# Altium schematic sheet uProcesador.SchDoc
size A4
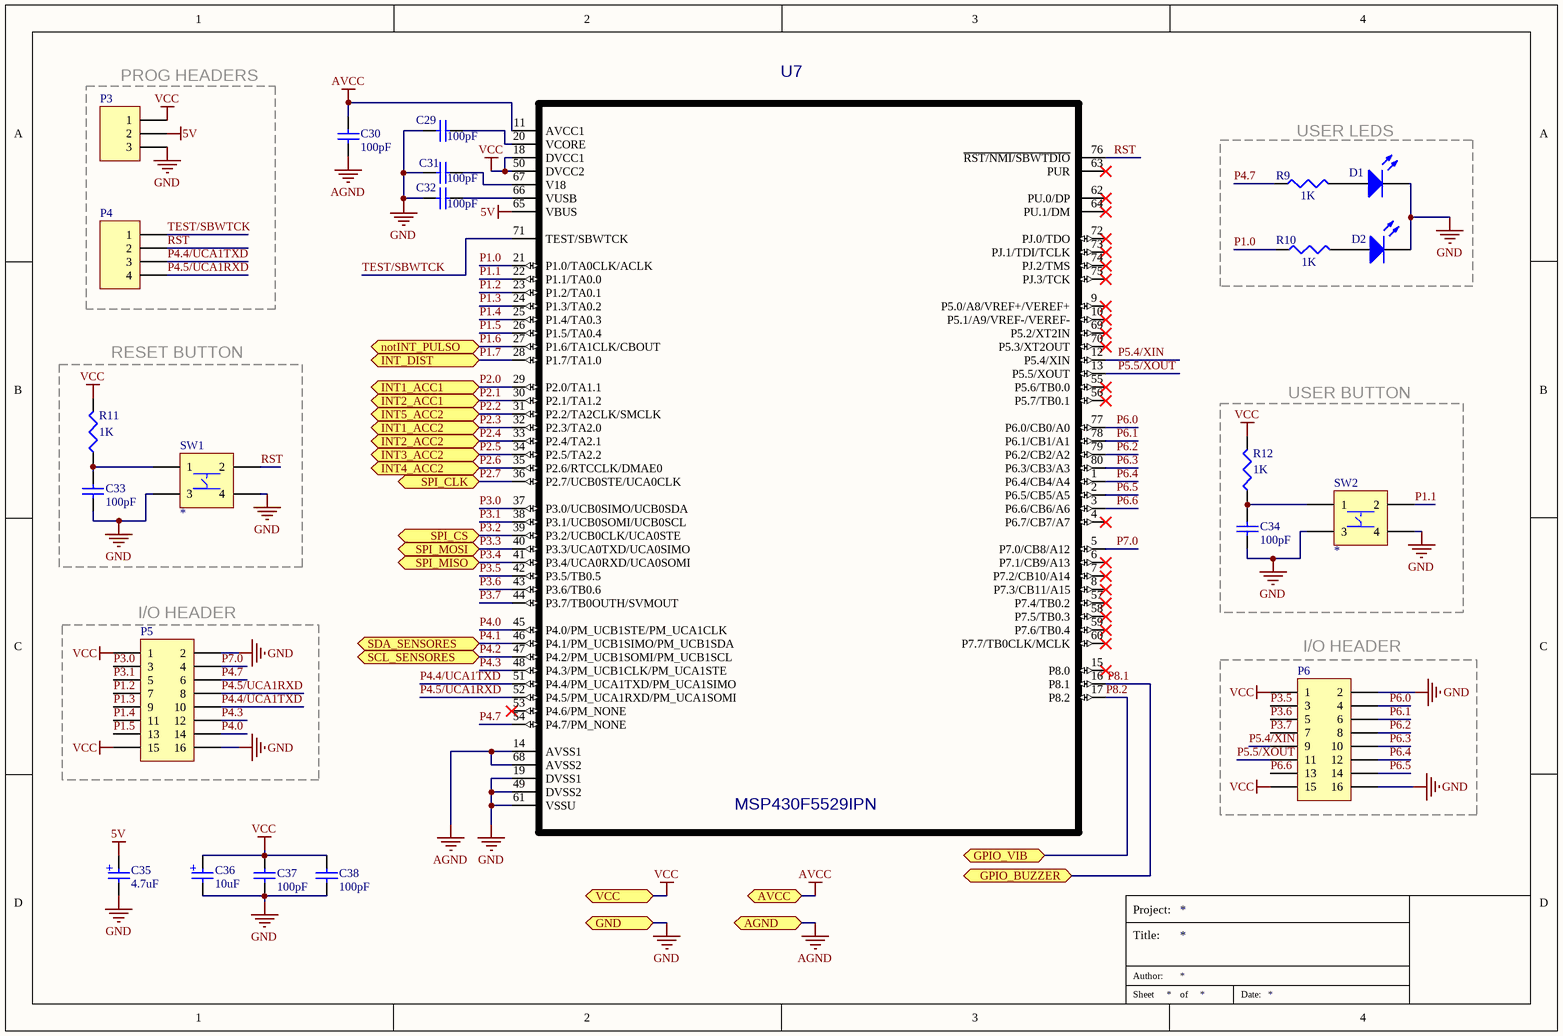
[diagram p0: uProcesador.SchDoc]

## Parts
C29  value 100pF  [C1206]
C30  value 100pF  [C1206]
C31  value 100pF  [C1206]
C32  value 100pF  [C1206]
C33  value 100pF  [C1206]
C34  value 100pF  [C1206]
C35  value 4.7uF  [Cap Pol]
C36  value 10uF  [Cap Pol]
C37  value 100pF  [C1206]
C38  value 100pF  [C1206]
D1  (no value)  [3.2X1.6X1.1]
D2  (no value)  [3.2X1.6X1.1]
P3  (no value)  [HDR1X3]
P4  (no value)  [HDR1X4]
P5  (no value)  [HDR2X8]
P6  (no value)  [HDR2X8]
R9  value 1K  [J1-0603]
R10  value 1K  [J1-0603]
R11  value 1K  [J1-0603]
R12  value 1K  [J1-0603]
SW1  *  [CKN9085CT]
SW2  *  [CKN9085CT]
U7  MSP430F5529IPN  [QFP50P1400X1400X160-80N]

## Ports
AGND, AVCC, GND, GPIO_BUZZER, GPIO_VIB, INT1_ACC1, INT1_ACC2, INT2_ACC1, INT2_ACC2, INT3_ACC2, INT4_ACC2, INT5_ACC2, INT_DIST, notINT_PULSO, SCL_SENSORES, SDA_SENSORES, SPI_CLK, SPI_CS, SPI_MISO, SPI_MOSI, VCC

## Nets
5V: C35.2 P3.2 U7.65(VBUS)
AGND: C30.1 U7.14(AVSS1) U7.68(AVSS2) ; port AGND
AVCC: C30.2 U7.11(AVCC1) ; port AVCC
GND: C29.2 C31.2 C32.2 C33.1 C34.1 C35.1 C36.1 C37.1 C38.1 D1.2(K) D2.2(K) P3.3 P5.2 P5.16 P6.2 P6.16 SW1.3 SW1.4 SW2.3 SW2.4 U7.19(DVSS1) U7.49(DVSS2) U7.61(VSSU) ; port GND
VCC: C36.2 C37.2 C38.2 P3.1 P5.1 P5.15 P6.1 P6.15 R11.2 R12.2 U7.18(DVCC1) U7.50(DVCC2) ; port VCC
P1.0: R10.1 U7.21(P1.0/TA0CLK/ACLK)
P1.1: SW2.2 U7.22(P1.1/TA0.0)
P1.2: P5.7 U7.23(P1.2/TA0.1)
P1.3: P5.9 U7.24(P1.3/TA0.2)
P1.4: P5.11 U7.25(P1.4/TA0.3)
P1.5: P5.13 U7.26(P1.5/TA0.4)
P1.6: U7.27(P1.6/TA1CLK/CBOUT) ; port notINT_PULSO
P1.7: U7.28(P1.7/TA1.0) ; port INT_DIST
P2.0: U7.29(P2.0/TA1.1) ; port INT1_ACC1
P2.1: U7.30(P2.1/TA1.2) ; port INT2_ACC1
P2.2: U7.31(P2.2/TA2CLK/SMCLK) ; port INT5_ACC2
P2.3: U7.32(P2.3/TA2.0) ; port INT1_ACC2
P2.4: U7.33(P2.4/TA2.1) ; port INT2_ACC2
P2.5: U7.34(P2.5/TA2.2) ; port INT3_ACC2
P2.6: U7.35(P2.6/RTCCLK/DMAE0) ; port INT4_ACC2
P2.7: U7.36(P2.7/UCB0STE/UCA0CLK) ; port SPI_CLK
P3.0: P5.3 U7.37(P3.0/UCB0SIMO/UCB0SDA)
P3.1: P5.5 U7.38(P3.1/UCB0SOMI/UCB0SCL)
P3.2: U7.39(P3.2/UCB0CLK/UCA0STE) ; port SPI_CS
P3.3: U7.40(P3.3/UCA0TXD/UCA0SIMO) ; port SPI_MOSI
P3.4: U7.41(P3.4/UCA0RXD/UCA0SOMI) ; port SPI_MISO
P3.5: P6.3 U7.42(P3.5/TB0.5)
P3.6: P6.5 U7.43(P3.6/TB0.6)
P3.7: P6.7 U7.44(P3.7/TB0OUTH/SVMOUT)
P4.0: P5.14 U7.45(P4.0/PM_UCB1STE/PM_UCA1CLK)
P4.1: U7.46(P4.1/PM_UCB1SIMO/PM_UCB1SDA) ; port SDA_SENSORES
P4.2: U7.47(P4.2/PM_UCB1SOMI/PM_UCB1SCL) ; port SCL_SENSORES
P4.3: P5.12 U7.48(P4.3/PM_UCB1CLK/PM_UCA1STE)
P4.4/UCA1TXD: P4.3 P5.10 U7.51(P4.4/PM_UCA1TXD/PM_UCA1SIMO)
P4.5/UCA1RXD: P4.4 P5.8 U7.52(P4.5/PM_UCA1RXD/PM_UCA1SOMI)
P4.7: P5.6 R9.1 U7.54(P4.7/PM_NONE)
P5.4/XIN: P6.9 U7.12(P5.4/XIN)
P5.5/XOUT: P6.11 U7.13(P5.5/XOUT)
P6.0: P6.4 U7.77(P6.0/CB0/A0)
P6.1: P6.6 U7.78(P6.1/CB1/A1)
P6.2: P6.8 U7.79(P6.2/CB2/A2)
P6.3: P6.10 U7.80(P6.3/CB3/A3)
P6.4: P6.12 U7.1(P6.4/CB4/A4)
P6.5: P6.14 U7.2(P6.5/CB5/A5)
P6.6: P6.13 U7.3(P6.6/CB6/A6)
P7.0: P5.4 U7.5(P7.0/CB8/A12)
P8.1: U7.16(P8.1) ; port GPIO_BUZZER
P8.2: U7.17(P8.2) ; port GPIO_VIB
RST: P4.2 SW1.2 U7.76(~{RST/NMI/SBWTDIO})
TEST/SBWTCK: P4.1 U7.71(TEST/SBWTCK)
NetC29_1: C29.1 U7.20(VCORE)
NetC31_1: C31.1 U7.67(V18)
NetC32_1: C32.1 U7.66(VUSB)
NetC33_2: C33.2 R11.1 SW1.1
NetC34_2: C34.2 R12.1 SW2.1
NetD1_1: D1.1(A) R9.2
NetD2_1: D2.1(A) R10.2

Not connected (* = marked no-connect by the designer): U7 4(P6.7/CB7/A7)* 6(P7.1/CB9/A13)* 7(P7.2/CB10/A14)* 8(P7.3/CB11/A15)* 9(P5.0/A8/VREF+/VEREF+)* 10(P5.1/A9/VREF-/VEREF-)* 15(P8.0)* 53(P4.6/PM_NONE)* 55(P5.6/TB0.0)* 56(P5.7/TB0.1)* 57(P7.4/TB0.2)* 58(P7.5/TB0.3)* 59(P7.6/TB0.4)* 60(P7.7/TB0CLK/MCLK)* 62(PU.0/DP)* 63(PUR)* 64(PU.1/DM)* 69(P5.2/XT2IN)* 70(P5.3/XT2OUT)* 72(PJ.0/TDO)* 73(PJ.1/TDI/TCLK)* 74(PJ.2/TMS)* 75(PJ.3/TCK)*

## Notes on the sheet
- (near P3) PROG HEADERS
- USER LEDS
- RESET BUTTON
- USER BUTTON
- (near P5) I/O HEADER
- (near P6) I/O HEADER
- Project:
- Title:
- Sheet
- Author:
- of
- Date:

## Library data of the parts
C29-C34 C37 C38 = Cap Semi: Capacitor (Semiconductor SIM Model); Published: 8-Jun-2000; LatestRevisionDate: 29-May-2009; LatestRevisionNote: IPC-7351 Footprint Added.; PackageReference: C1206; Publisher: Altium Limited; PackageDescription: Chip Capacitor
C35 C36 = Cap Pol: Capacitor pol; Published: 8-Jun-2000; LatestRevisionDate: 29-May-2009; LatestRevisionNote: IPC-7351 Footprint Added.; PackageReference: C1206; Publisher: Altium Limited; PackageDescription: Chip Capacitor
D1 D2 = LED2: Typical RED, GREEN, YELLOW, AMBER GaAs LED; Published: 8-Jun-2000; LatestRevisionDate: 17-Jul-2002; LatestRevisionNote: Re-released for DXP Platform.; PackageVersion: Feb-2002; PackageReference: 3.2X1.6X1.1; Publisher: Altium Limited; PackageDescription: SM LED; 2 Flat Leads
P3 = Header 3: Header, 3-Pin; LatestRevisionDate: 17-Jul-2002; LatestRevisionNote: Re-released for DXP Platform.; Publisher: Altium Limited
P4 = Header 4: Header, 4-Pin; LatestRevisionDate: 17-Jul-2002; LatestRevisionNote: Re-released for DXP Platform.; Publisher: Altium Limited
P5 P6 = Header 8X2: Header, 8-Pin, Dual row; LatestRevisionDate: 17-Jul-2002; LatestRevisionNote: Re-released for DXP Platform.; Publisher: Altium Limited
R9-R12 = Res3: Resistor; Published: 8-Jun-2000; LatestRevisionDate: 29-May-2009; LatestRevisionNote: IPC-7351 Footprint Added.; PackageReference: J1-0603; Publisher: Altium Limited; PackageDescription: Chip Resistor
SW1 SW2 = CKN9085CT
U7 = MSP430F5529IPN: 16-Bit Ultra-Low-Power Microcontroller, 128KB Flash, 8KB RAM, USB, 12Bit ADC, 2 USCIs, 32Bit HW MPY 80-LQFP -40 to 85; MF: Texas Instruments; Price: 6.15 USD; MP: MSP430F5529IPN; Package: LQFP-80 Texas Instruments; Availability: Good; Value: *